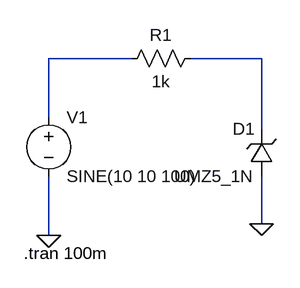
[diagram p0: schematic aula2_3.asc]
aula2_3.asc, the LTspice schematic file:
Version 4
SHEET 1 880 680
WIRE 160 48 48 48
WIRE 336 48 240 48
WIRE 48 128 48 48
WIRE 336 144 336 48
WIRE 336 272 336 208
WIRE 48 288 48 208
FLAG 336 272 0
FLAG 48 288 0
SYMBOL voltage 48 112 R0
WINDOW 123 0 0 Left 0
WINDOW 39 0 0 Left 0
SYMATTR InstName V1
SYMATTR Value SINE(10 10 100)
SYMBOL res 256 32 R90
WINDOW 0 0 56 VBottom 2
WINDOW 3 32 56 VTop 2
SYMATTR InstName R1
SYMATTR Value 1k
SYMBOL zener 352 208 R180
WINDOW 0 24 64 Left 2
WINDOW 3 24 0 Left 2
SYMATTR InstName D1
SYMATTR Value UMZ5_1N
SYMATTR Description Diode
SYMATTR Type diode
TEXT 14 312 Left 2 !.tran 100m

The netlist it stands for:
* aula2_3.asc
V1 N001 0 SINE(10 10 100)
R1 N002 N001 1k
D1 0 N002 UMZ5_1N
.model D D
.lib standard.dio
.tran 100m
.backanno
.end